# EAGLE design trigger (EAGLE 7.5.0)
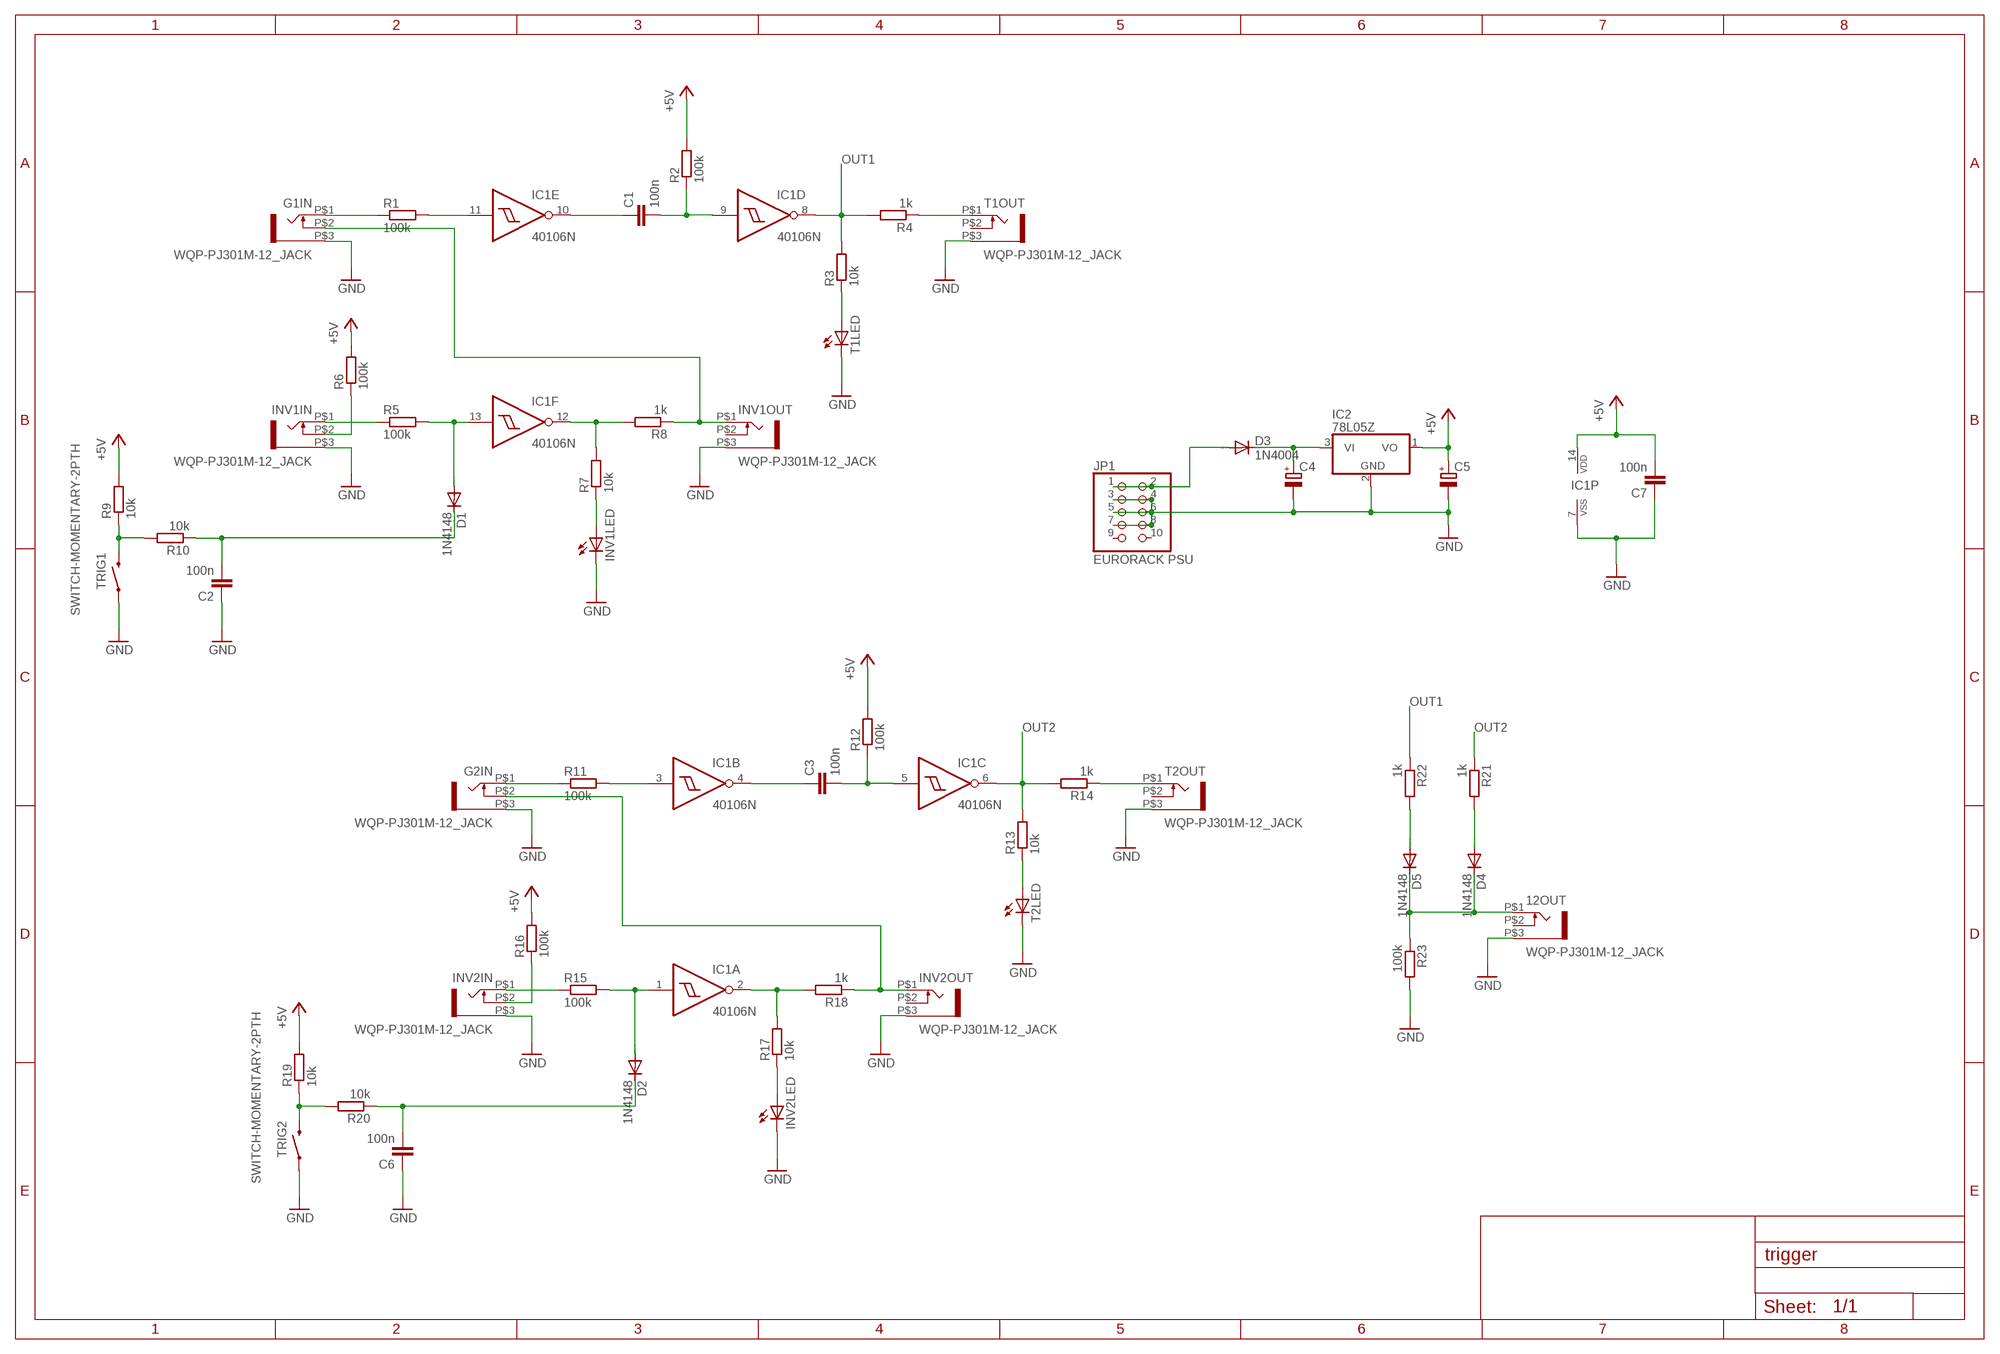
[diagram p0: schematic, sheet 1]

## Parts
12OUT  WQP-PJ301M-12_JACK  [WQP-PJ301M-12_JACK]
C1  100n  C-EU025-025X050  [C025-025X050]
C2  100n  C-EU025-025X050  [C025-025X050]
C3  100n  C-EU025-025X050  [C025-025X050]
C4  CPOL-EUE2.5-5  [E2,5-5]
C5  CPOL-EUE2.5-5  [E2,5-5]
C6  100n  C-EU025-025X050  [C025-025X050]
C7  100n  C-EU025-025X050  [C025-025X050]
D1  1N4148  DIODE-D-2.5  [D-2.5]
D2  1N4148  DIODE-D-2.5  [D-2.5]
D3  1N4004  DIODE-D-2.5  [D-2.5]
D4  1N4148  DIODE-D-2.5  [D-2.5]
D5  1N4148  DIODE-D-2.5  [D-2.5]
G1IN  WQP-PJ301M-12_JACK  [WQP-PJ301M-12_JACK]
G2IN  WQP-PJ301M-12_JACK  [WQP-PJ301M-12_JACK]
IC1  40106N  [DIL14]
IC2  78L05Z  [TO92]
INV1IN  WQP-PJ301M-12_JACK  [WQP-PJ301M-12_JACK]
INV1LED  LED3MM  [LED3MM]
INV1OUT  WQP-PJ301M-12_JACK  [WQP-PJ301M-12_JACK]
INV2IN  WQP-PJ301M-12_JACK  [WQP-PJ301M-12_JACK]
INV2LED  LED3MM  [LED3MM]
INV2OUT  WQP-PJ301M-12_JACK  [WQP-PJ301M-12_JACK]
JP1  EURORACK PSU  PINHD-2X5  [2X05]
R1  100k  R-EU_0204/2V  [0204V]
R2  100k  R-EU_0204/2V  [0204V]
R3  10k  R-EU_0204/2V  [0204V]
R4  1k  R-EU_0204/2V  [0204V]
R5  100k  R-EU_0204/2V  [0204V]
R6  100k  R-EU_0204/2V  [0204V]
R7  10k  R-EU_0204/2V  [0204V]
R8  1k  R-EU_0204/2V  [0204V]
R9  10k  R-EU_0204/2V  [0204V]
R10  10k  R-EU_0204/2V  [0204V]
R11  100k  R-EU_0204/2V  [0204V]
R12  100k  R-EU_0204/2V  [0204V]
R13  10k  R-EU_0204/2V  [0204V]
R14  1k  R-EU_0204/2V  [0204V]
R15  100k  R-EU_0204/2V  [0204V]
R16  100k  R-EU_0204/2V  [0204V]
R17  10k  R-EU_0204/2V  [0204V]
R18  1k  R-EU_0204/2V  [0204V]
R19  10k  R-EU_0204/2V  [0204V]
R20  10k  R-EU_0204/2V  [0204V]
R21  1k  R-EU_0204/2V  [0204V]
R22  1k  R-EU_0204/2V  [0204V]
R23  100k  R-EU_0204/2V  [0204V]
T1LED  LED3MM  [LED3MM]
T1OUT  WQP-PJ301M-12_JACK  [WQP-PJ301M-12_JACK]
T2LED  LED3MM  [LED3MM]
T2OUT  WQP-PJ301M-12_JACK  [WQP-PJ301M-12_JACK]
TRIG1  SWITCH-MOMENTARY-2PTH  [TACTILE-PTH]
TRIG2  SWITCH-MOMENTARY-2PTH  [TACTILE-PTH]

## Nets
+5V: C5.+ C7.2 IC1.14(P:VDD) IC2.1(VO) R2.2 R6.2 R9.2 R12.2 R16.2 R19.2
+12V_IN: D3.A JP1.1 JP1.2
GND: 12OUT.P$3 C2.1 C4.- C5.- C6.1 C7.1 G1IN.P$3 G2IN.P$3 IC1.7(P:VSS) IC2.2(GND) INV1IN.P$3 INV1LED.K(C) INV1OUT.P$3 INV2IN.P$3 INV2LED.K(C) INV2OUT.P$3 JP1.3 JP1.4 JP1.5 JP1.6 JP1.7 JP1.8 R23.2 T1LED.K(C) T1OUT.P$3 T2LED.K(C) T2OUT.P$3 TRIG1.1 TRIG2.1
IN_1: G1IN.P$1 R1.1
N$1: 12OUT.P$1 D4.C D5.C R23.1
N$2: IC1.11(E:I) R1.2
N$3: C1.1 IC1.10(E:O)
N$4: C1.2 IC1.9(D:I) R2.1
N$5: D5.A R22.2
N$6: R3.1 T1LED.A
N$7: R4.1 T1OUT.P$1
N$8: IC1.12(F:O) R7.2 R8.2
N$9: INV1LED.A R7.1
N$10: G1IN.P$2 INV1OUT.P$1 R8.1
N$11: INV1IN.P$1 R5.1
N$12: D1.A IC1.13(F:I) R5.2
N$13: INV1IN.P$2 R6.1
N$14: C4.+ D3.C IC2.3(VI)
N$15: R9.1 R10.2 TRIG1.3
N$16: C2.2 D1.C R10.1
N$17: G2IN.P$1 R11.1
N$18: IC1.3(B:I) R11.2
N$19: C3.1 IC1.4(B:O)
N$20: C3.2 IC1.5(C:I) R12.1
N$21: D4.A R21.2
N$22: R13.1 T2LED.A
N$23: R14.1 T2OUT.P$1
N$24: IC1.2(A:O) R17.2 R18.2
N$25: INV2LED.A R17.1
N$26: G2IN.P$2 INV2OUT.P$1 R18.1
N$27: INV2IN.P$1 R15.1
N$28: D2.A IC1.1(A:I) R15.2
N$29: INV2IN.P$2 R16.1
N$30: R19.1 R20.2 TRIG2.3
N$31: C6.2 D2.C R20.1
OUT1: IC1.8(D:O) R3.2 R4.2 R22.1
OUT2: IC1.6(C:O) R13.2 R14.2 R21.1
Unconnected: 12OUT.P$2 INV1OUT.P$2 INV2OUT.P$2 JP1.9 JP1.10 T1OUT.P$2 T2OUT.P$2

## Library data of the parts
12OUT G1IN G2IN INV1IN INV1OUT INV2IN INV2OUT T1OUT T2OUT = thonkiconn:WQP-PJ301M-12_JACK
C1-C3 C6 C7 = rcl:C-EU: CAPACITOR, European symbol
C4 C5 = rcl:CPOL-EU: POLARIZED CAPACITOR, European symbol
D1-D5 = diode:DIODE-: DIODE
IC1 = 40xx:40106: Hex SCHMITT TRIGGER
IC2 = linear:78*: Positive VOLTAGE REGULATOR Source: http://cache.national.com/ds/LM/LM78L05.pdf http://www.fairchildsemi.com/ds/LM/LM7805.pdf
INV1LED INV2LED T1LED T2LED = led:LED: LED OSRAM: - CHIPLED LG R971, LG N971, LY N971, LG Q971, LY Q971, LO R971, LY R971 LH N974, LH R974 LS Q976, LO Q976, LY Q976 LO Q996 - Hyper CHIPLED LW Q18S LB Q993, LB Q99A, LB R99A - SideLED LS A670, LO A670, LY A670, LG A670, LP A670 LB A673, LV A673, LT A673, LW A673 LH A674 LY A675 LS A676, LA A676, LO A676, LY A676, LW A676 LS A679, LY A679, LG A679 - Hyper Micro SIDELED® LS Y876, LA Y876, LO Y876, LY Y876 LT Y87S - SmartLED LW L88C, LW L88S LB L89C, LB L89S, LG L890 LS L89K, LO L89K, LY L89K LS L896, LA L896, LO L896, LY L896 - TOPLED LS T670, LO T670, LY T670, LG T670, LP T670 LSG T670, LSP T670, LSY T670, LOP T670, LYG T670 LG T671, LOG T671, LSG T671 LB T673, LV T673, LT T673, LW T673 LH T674 LS T676, LA T676, LO T676, LY T676, LB T676, LH T676, LSB T676, LW T676 LB T67C, LV T67C, LT T67C, LS T67K, LO T67K, LY T67K, LW E67C LS E67B, LA E67B, LO E67B, LY E67B, LB E67C, LV E67C, LT E67C LW T67C LS T679, LY T679, LG T679 LS T770, LO T770, LY T770, LG T770, LP T770 LB T773, LV T773, LT T773, LW T773 LH T774 LS E675, LA E675, LY E675, LS T675 LS T776, LA T776, LO T776, LY T776, LB T776 LHGB T686 LT T68C, LB T68C - Hyper Mini TOPLED® LB M676 - Mini TOPLED Santana® LG M470 LS M47K, LO M47K, LY M47K Source: http://www.osram.convergy.de LUXEON: - LUMILED® LXK2-PW12-R00, LXK2-PW12-S00, LXK2-PW14-U00, LXK2-PW14-V00 LXK2-PM12-R00, LXK2-PM12-S00, LXK2-PM14-U00 LXK2-PE12-Q00, LXK2-PE12-R00, LXK2-PE12-S00, LXK2-PE14-T00, LXK2-PE14-U00 LXK2-PB12-K00, LXK2-PB12-L00, LXK2-PB12-M00, LXK2-PB14-N00, LXK2-PB14-P00, LXK2-PB14-Q00 LXK2-PR12-L00, LXK2-PR12-M00, LXK2-PR14-Q00, LXK2-PR14-R00 LXK2-PD12-Q00, LXK2-PD12-R00, LXK2-PD12-S00 LXK2-PH12-R00, LXK2-PH12-S00 LXK2-PL12-P00, LXK2-PL12-Q00, LXK2-PL12-R00 Source: www.luxeon.com KINGBRIGHT: KA-3528ASYC Source: www.kingbright.com
JP1 = pinhead:PINHD-2X5: PIN HEADER
R1-R23 = rcl:R-EU_: RESISTOR, European symbol
TRIG1 TRIG2 = SparkFun-Electromechanical:SWITCH-MOMENTARY-2: Various NO switches- pushbuttons, reed, etc; PROD_ID: SWCH-08441

## Board
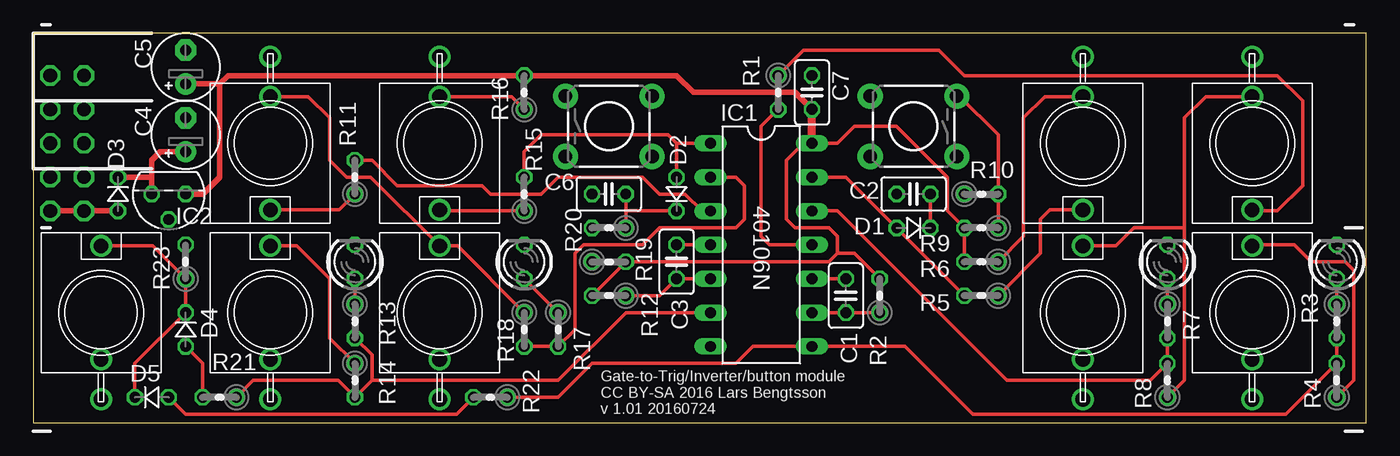
[diagram p1: board, top side]
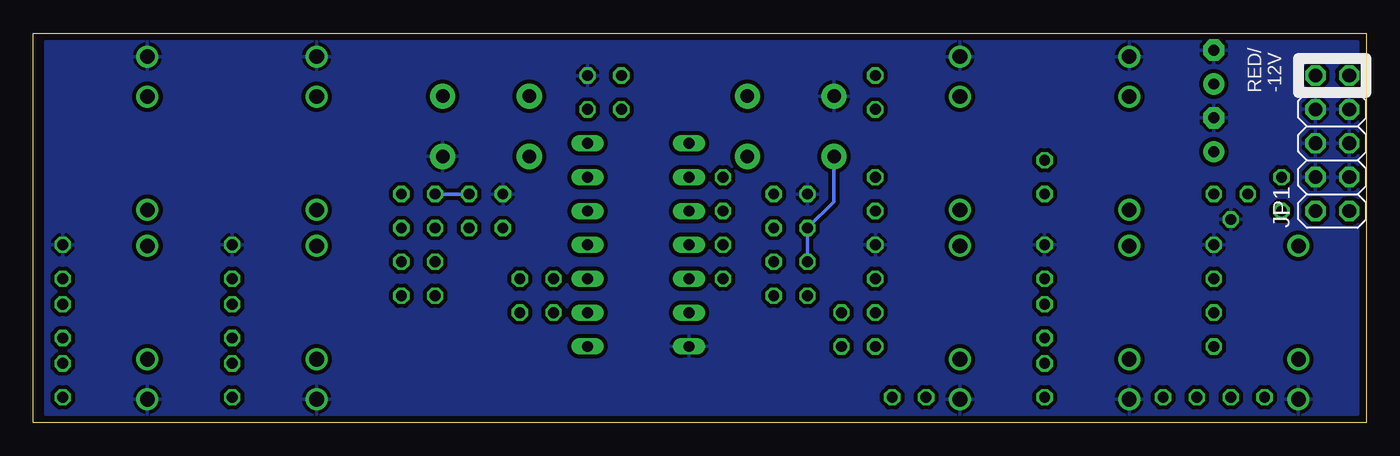
[diagram p2: board, bottom side, seen from below]

Size 100 x 29.2 mm. Coordinates in mm from the lower left corner, seen from the top.
Outline: 0,0 100,0 100,29.2 0,29.2 0,0
Copper layers (1*16): Top 0.0356mm / dielectric 1.5011mm / Bottom 0.0356mm
Design rules "Laen OSH Park PCBOrder": minimum track width 6mil, minimum drill 13mil, track to track 6mil, track to pad 6mil, pad to pad 6mil, via to via 6mil, smd to smd 6mil, copper to edge 15mil, drill to drill 6mil, minimum pad ring 7mil, minimum via ring 7mil, stop-mask expansion 3mil, vias tented up to drill 0mil, thermal gap 10mil

### Footprints (pad centres in the part's own frame; a part is rotated, then mirrored left to right if it is on the bottom)
WQP-PJ301M-12_JACK = drill 1.1: P$1 0,5; P$2 0,-3.5; P$3 0,-6.5
C025-025X050 = drill 0.813 octagon: 1 -1.27,0; 2 1.27,0
E2,5-5 = drill 0.813 pad 1.6: + -1.27,0 | drill 0.813 pad 1.6 octagon: - 1.27,0
D-2.5 = drill 0.813 octagon: A 1.27,0; C -1.27,0
DIL14 = drill 0.813 long: 1 -7.62,-3.81; 2 -5.08,-3.81; 3 -2.54,-3.81; 4 0,-3.81; 5 2.54,-3.81; 6 5.08,-3.81; 7 7.62,-3.81; 8 7.62,3.81; 9 5.08,3.81; 10 2.54,3.81; 11 0,3.81; 12 -2.54,3.81; 13 -5.08,3.81; 14 -7.62,3.81
TO92 = drill 0.813 octagon: 1 -1.27,0; 2 0,1.905; 3 1.27,0
LED3MM = drill 0.813 octagon: A -1.27,0; K 1.27,0
2X05 = drill 1.016 octagon: 1 -5.08,-1.27; 2 -5.08,1.27; 3 -2.54,-1.27; 4 -2.54,1.27; 5 0,-1.27; 6 0,1.27; 7 2.54,-1.27; 8 2.54,1.27; 9 5.08,-1.27; 10 5.08,1.27
0204V = drill 0.813 octagon: 1 -1.27,0; 2 1.27,0
TACTILE-PTH = drill 1.016 pad 1.88: 1 -3.251,2.261; 2 3.251,2.261; 3 -3.251,-2.261; 4 3.251,-2.261

### Placement (x,y rotation side)
12OUT  5.08,8.26 0 top
C1  60.96,9.53 270 top
C2  66.04,17.15 0 top
C3  48.26,12.06 270 top
C4  11.43,21.59 90 top
C5  11.43,26.67 90 top
C6  43.18,17.15 0 top
C7  58.42,24.77 270 top
D1  66.04,14.6 180 top
D2  48.26,17.15 90 top
D3  6.35,17.15 270 top
D4  11.43,6.99 270 top
D5  8.89,1.9 0 top
G1IN  91.44,20.95 180 top
G2IN  17.78,20.95 180 top
IC1  54.61,13.33 270 top
IC2  10.16,17.15 180 top
INV1IN  78.74,20.95 180 top
INV1LED  85.09,12.06 90 top
INV1OUT  78.74,8.26 0 top
INV2IN  30.48,20.95 180 top
INV2LED  36.83,12.06 90 top
INV2OUT  30.48,8.26 0 top
JP1  2.54,20.95 90 bottom
R1  55.88,24.77 270 top
R2  63.5,9.53 90 top
R3  97.79,7.62 270 top
R4  97.79,3.18 90 top
R5  71.12,9.53 180 top
R6  71.12,12.06 180 top
R7  85.09,7.62 270 top
R8  85.09,3.18 90 top
R9  71.12,14.6 180 top
R10  71.12,17.15 0 top
R11  24.13,18.41 90 top
R12  43.18,9.53 180 top
R13  24.13,7.62 270 top
R14  24.13,3.18 270 top
R15  36.83,17.15 90 top
R16  36.83,24.77 90 top
R17  39.37,6.99 270 top
R18  36.83,6.99 270 top
R19  43.18,12.06 0 top
R20  43.18,14.6 180 top
R21  13.97,1.9 180 top
R22  34.29,1.9 180 top
R23  11.43,12.06 90 top
T1LED  97.79,12.06 90 top
T1OUT  91.44,8.26 0 top
T2LED  24.13,12.06 90 top
T2OUT  17.78,8.26 0 top
TRIG1  66.04,22.23 180 top
TRIG2  43.18,22.23 0 top

### Tracks (layer width: path | path; a pad name or v marks a point on that pad's centre or on a via)
+5V
  Top 0.254: R12.2 R19.2 59.69,12.06 60.33,12.7 | 60.33,12.7 60.33,13.97 59.69,14.6 57.15,14.6 56.52,15.24 56.52,19.69 57.78,20.95 IC1.14 60.33,20.95 61.59,22.23 64.77,22.23 68.58,18.41 68.58,15.88 R9.2 R6.2 | R2.2 61.59,12.7 60.33,12.7
  Top 0.406: C7.2 57.15,24.77 49.53,24.77 48.26,26.03 37.47,26.03 R16.2 14.61,26.03 13.97,25.4 | IC2.1 12.7,17.15 13.97,18.41 13.97,25.4 | 13.97,25.4 C5.+
  Top 0.61: IC1.14 C7.2
+12V_IN
  Top 0.406: D3.A JP1.2 JP1.1
GND
  pour Bottom (isolate 0.305): 0.64,28.57 99.06,28.57 99.06,0.63 0.64,0.63
IN_1
  Top 0.254: G1IN.P$1 91.52,15.88 93.34,15.88 95.25,17.78 95.25,24.13 93.34,26.03 69.85,26.03 67.94,27.94 57.78,27.94 R1.1
N$1
  Top 0.254: 12OUT.P$1 8.97,13.26 R23.1 D4.C 7.62,4.45 D5.C
N$2
  Top 0.254: IC1.11 55.24,13.33 54.61,13.97 54.61,22.23 R1.2
N$3
  Top 0.254: IC1.10 C1.1
N$4
  Top 0.254: IC1.9 C1.2 R2.1
N$5
  Top 0.254: R22.2 31.75,0.63 11.43,0.63 D5.A
N$6
  Top 0.254: R3.1 T1LED.A
N$7
  Top 0.254: R4.1 99.06,3.18 99.06,11.43 98.42,12.06 95.89,12.06 94.61,13.33 91.52,13.33 T1OUT.P$1
N$8
  Top 0.254: R7.2 R8.2 83.82,3.18 73.03,3.18 60.33,15.88 IC1.12
N$9
  Top 0.254: INV1LED.A R7.1
N$10
  Top 0.254: R8.1 86.36,3.18 86.36,14.6 | 86.36,14.6 86.36,22.86 87.95,24.45 G1IN.P$2 | INV1OUT.P$1 81.2,13.26 82.55,14.6 86.36,14.6
N$11
  Top 0.254: INV1IN.P$1 76.28,15.96 75.56,15.24 75.56,12.7 R5.1
N$12
  Top 0.254: IC1.13 60.96,18.41 D1.A R5.2
N$13
  Top 0.254: INV1IN.P$2 75.89,24.45 74.3,22.86 74.3,13.97 R6.1
N$14
  Top 0.406: IC2.3 8.89,18.41 | 8.89,18.41 8.89,19.69 9.53,20.32 C4.+ | D3.C 8.89,18.41
N$15
  Top 0.254: TRIG1.3 69.49,24.49 72.39,21.59 R10.2 R9.1
N$16
  Top 0.254: D1.C C2.2
  Bottom 0.254: C2.2 R10.1
N$17
  Top 0.254: G2IN.P$1 22.94,15.96 R11.1
N$18
  Top 0.254: R11.2 25.4,19.69 27.3,17.78 33.66,17.78 34.29,17.15 38.1,17.15 39.37,18.41 45.72,18.41 46.99,17.15 48.9,17.15 50.16,15.88 IC1.3
N$19
  Top 0.254: IC1.4 C3.1
N$20
  Top 0.254: IC1.5 C3.2 46.99,9.53 R12.1
N$21
  Top 0.254: D4.A 12.7,4.45 R21.2
N$22
  Top 0.254: T2LED.A R13.1
N$23
  Top 0.254: T2OUT.P$1 19.77,13.26 22.23,10.79 22.23,6.35 R14.1
N$24
  Top 0.254: IC1.2 52.7,18.41 53.34,17.78 53.34,15.24 52.7,14.6 46.99,14.6 45.72,13.33 41.27,13.33 40.64,12.7 40.64,6.99 R17.2 R18.2
N$25
  Top 0.254: INV2LED.A R17.1
N$26
  Top 0.254: G2IN.P$2 20.63,24.45 22.23,22.86 22.23,19.69 23.5,18.41 25.32,18.41 INV2OUT.P$1 31.83,13.26 R18.1
N$27
  Top 0.254: R15.1 30.56,15.88 INV2IN.P$1
N$28
  Top 0.254: R15.2 36.83,20.32 38.1,21.59 47.62,21.59 48.26,20.95 | 48.26,20.95 IC1.1 | 48.26,20.95 D2.A
N$29
  Top 0.254: INV2IN.P$2 35.87,24.45 R16.1
N$30
  Bottom 0.254: R19.1 R20.2 39.93,16.59 TRIG2.3
N$31
  Top 0.254: R20.1 44.45,15.88 | 44.45,15.88 C6.2 | D2.C 44.45,15.88
OUT1
  Top 0.254: R3.2 R4.2 93.98,0.63 70.48,0.63 65.41,5.72 IC1.8 53.98,5.72 52.7,4.45 41.91,4.45 39.37,1.9 R22.1
OUT2
  Top 0.254: R21.1 16.51,3.18 22.86,3.18 R14.2 25.4,3.18 | IC1.6 44.45,8.26 39.37,3.18 25.4,3.18 | R13.2 25.4,5.08 25.4,3.18

### Text on the board
tPlace: Gate-to-Trig/Inverter/button module / CC BY-SA 2016 Lars Bengtsson / v 1.01 20160724
bPlace: RED/ / -12V